# Altium schematic sheet DAC Output.SchDoc
size 297 x 209 mm; CompanyName: Sainsbury Wellcome Centre; Organization: FabLab; Address1: Sainsbury Wellcome Centre; Address2: 25 Howland Street; Address3: London; Address4: W1T 4JG; DocumentNumber: 11; SheetNumber: 11; SheetTotal: 12; swcgroup: FabLab; Org: Sainsbury Wellcome Centre; Add1: 25 Howland Street; Add2: London; Add3: W1T 4JG; WebAddress: www.sainsburywellcome.org; SheetSize: A4; SheetName: Level Shifter
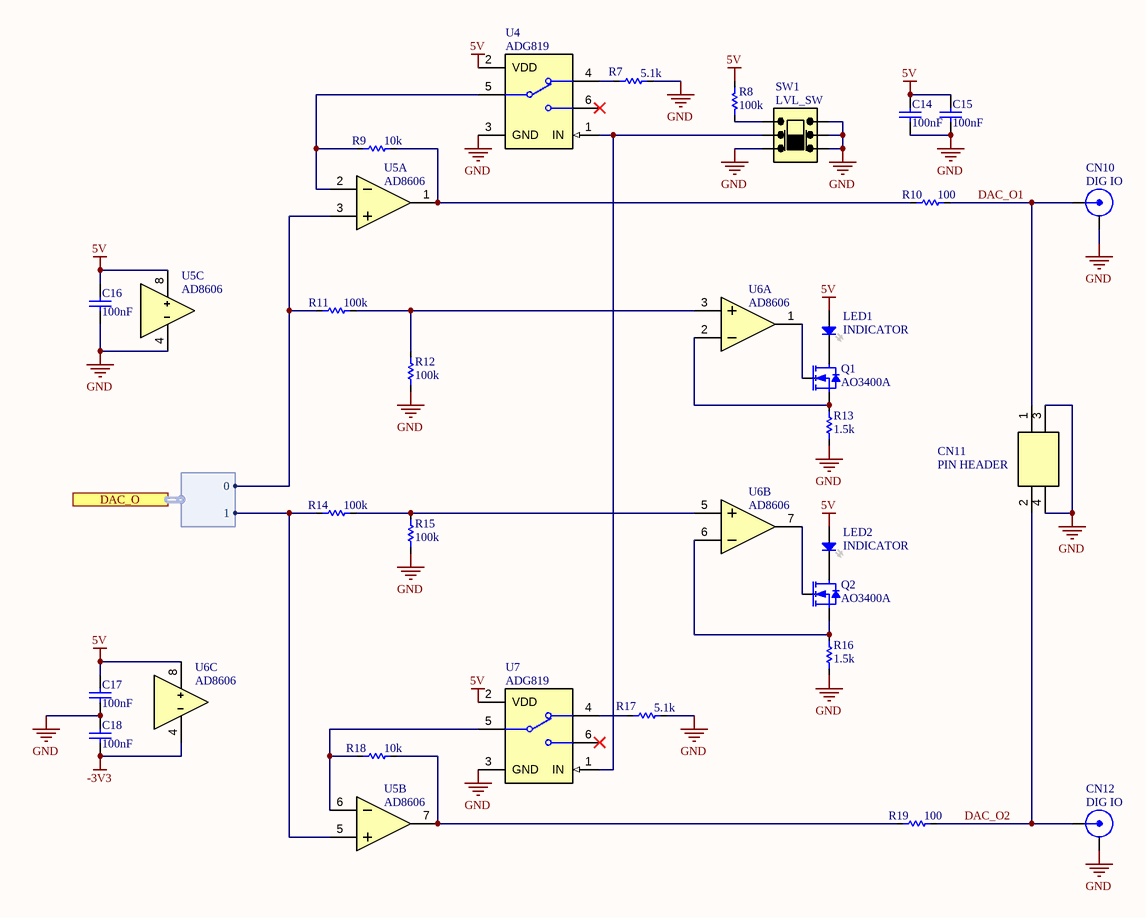
[diagram p0: DAC Output.SchDoc]

## Parts
C14  value 100nF  [CAP_CHIP_0603]  (hidden comment: C0603-100nF-50V)
C15  value 100nF  [CAP_CHIP_0603]  (hidden comment: C0603-100nF-50V)
C16  value 100nF  [CAP_CHIP_0603]  (hidden comment: C0603-100nF-50V)
C17  value 100nF  [CAP_CHIP_0603]  (hidden comment: C0603-100nF-50V)
C18  value 100nF  [CAP_CHIP_0603]  (hidden comment: C0603-100nF-50V)
CN10  DIG IO  [BNC-AMP-112515]
CN11  PIN HEADER  [PIN_2.54_2X2P]
CN12  DIG IO  [BNC-AMP-112515]
LED1  INDICATOR  [LED_CHIP_0805]
LED2  INDICATOR  [LED_CHIP_0805]
Q1  AO3400A  [SOT23]
Q2  AO3400A  [SOT23]
R7  value 5.1k  [RES_CHIP_0603]  (hidden comment: R0603-5K1)
R8  value 100k  [RES_CHIP_0603]  (hidden comment: R0603-100K)
R9  value 10k  [RES_CHIP_0603]  (hidden comment: R0603-10K)
R10  value 100  [RES_CHIP_0603]  (hidden comment: R0603-100R)
R11  value 100k  [RES_CHIP_0603]  (hidden comment: R0603-100K)
R12  value 100k  [RES_CHIP_0603]  (hidden comment: R0603-100K)
R13  value 1.5k  [RES_CHIP_0603]  (hidden comment: R0603-1K5)
R14  value 100k  [RES_CHIP_0603]  (hidden comment: R0603-100K)
R15  value 100k  [RES_CHIP_0603]  (hidden comment: R0603-100K)
R16  value 1.5k  [RES_CHIP_0603]  (hidden comment: R0603-1K5)
R17  value 5.1k  [RES_CHIP_0603]  (hidden comment: R0603-5K1)
R18  value 10k  [RES_CHIP_0603]  (hidden comment: R0603-10K)
R19  value 100  [RES_CHIP_0603]  (hidden comment: R0603-100R)
SW1  LVL_SW  [SW_SLIDE_OS202013MT8]
U4  ADG819  [SOT23-6]
U5  AD8606  [VSSOP8_3X3_0.65E]  (parts A,B,C of 3)
U6  AD8606  [VSSOP8_3X3_0.65E]  (parts A,B,C of 3)
U7  ADG819  [SOT23-6]

## Ports
DAC_O (harness DAC_O)

## Harnesses
DAC_O: 1, 0

## Nets
5V: C14.2 C15.2 C16.2 C17.2 LED1.2(A) LED2.2(A) R8.2 U4.2(VDD) U5.8(V+) U6.8(V+) U7.2(VDD)
-3V3: C18.1 U6.4(V-)
GND: C14.1 C15.1 C16.1 C17.1 C18.2 CN10.2(GND) CN11.3 CN11.4 CN12.2(GND) R7.2 R12.1 R13.1 R15.1 R16.1 R17.2 SW1.1(NCA) SW1.4(NCB) SW1.5(COMB) SW1.6(NOB) U4.3(GND) U5.4(V-) U7.3(GND)
DAC_O1: CN10.1(SIG) CN11.1 R10.2
DAC_O2: CN11.2 CN12.1(SIG) R19.2
NetLED1_1: LED1.1(K) Q1.3(D)
NetLED2_1: LED2.1(K) Q2.3(D)
NetQ1_1: Q1.1(G) U6.1(AOUT)
NetQ1_2: Q1.2(S) R13.2 U6.2(A-)
NetQ2_1: Q2.1(G) U6.7(BOUT)
NetQ2_2: Q2.2(S) R16.2 U6.6(B-)
NetR7_1: R7.1 U4.4(S1)
NetR8_1: R8.1 SW1.3(NOA)
NetR9_1: R9.1 U4.5(D) U5.2(A-)
NetR9_2: R9.2 R10.1 U5.1(AOUT)
NetR11_1: R11.1 R12.2 U6.3(A+)
NetR11_2: R11.2 U5.3(A+) ; port DAC_O.0
NetR14_1: R14.1 R15.2 U6.5(B+)
NetR14_2: R14.2 U5.5(B+) ; port DAC_O.1
NetR17_1: R17.1 U7.4(S1)
NetR18_1: R18.1 U5.6(B-) U7.5(D)
NetR18_2: R18.2 R19.1 U5.7(BOUT)
NetSW1_2: SW1.2(COMA) U4.1(IN) U7.1(IN)

Not connected (* = marked no-connect by the designer): U4 6(S2)*; U7 6(S2)*

## Notes on the sheet
- FILE
- VARIANT
- DATE
- REVISION
- SHEET
- /
- PROJECT
- SIZE

## Library data of the parts
C14-C18 = CMP-611-0027-24: 0603 Multilayer Ceramic Capacitors MLCC; PartNumber: CC0603KRX7R9BB104; Tolerance: 10%; Pick&PlaceFootprint: C0603; Dielectric: X7R; Voltage Rating: 50V; Capacitor Type: Ceramic; RoHS: Yes; Mount: SMD; LCSC Part N.: C14663; Case/Package: 0603
CN10 CN12 = CMP-730-0003-11: RF BNC Connector, Female, Board Mount, Solder Terminal, Jack; PartNumber: 112515; Clock Frequency: 4GHz; Characteristic Impedance: 50R; LCSC Part N.: C3176191; Orientation: Straight; Connector Type: BNC; Gender: Female
CN11 = CMP-380-0037-5: Straight Policy 2.5mm 6mm -40℃~+105℃ 3mm 2.54mm Double Row Black Brass 2.54mm Plugin,P=2.54mm Pin Headers; PartNumber: PZ254V-12-4P; Gender: Male; Number of Contacts: 4; Number of Positions: 2; Pitch: 2.54mm; Number of Rows: 2; Mount: Through Hole; Orientation: Straight; LCSC Part N.: C492419
LED1 LED2 = CMP-520-0018-2: White 0805 Light Emitting Diodes (LED) ROHS; PartNumber: KT-0805W; Forward Current: 25mA; Wavelength: 405nm; Pick&PlaceFootprint: LED0805; Forward Voltage: 2.9V; Colour: White; LCSC Part N.: C34499; Mount: Surface Mount
Q1 Q2 = CMP-810-0002-2: 30V 5.7A 26.5mΩ@10V,5.7A 1.4W 1.5V@250uA 1 NChannel SOT-23-3L MOSFETs; Gate-Source Voltage (Vgs): 12V; Pick&PlaceFootprint: SOT-23; RDS(ON): 26.5mR; Switching Time: 34.5ns; LCSC Part N.: C20917; Drain-Source Voltage (Vds): 30V; Mount: Surface Mount; PartNumber: AO3400A; Power Dissipation: 1.4W; Drain Current (Id): 5.7A; Polarity: N Channel
R7 R17 = CMP-633-0090-12: 100mW Thick Film Resistors 75V ±100ppm/℃ ±1% 0603 Chip Resistor; PartNumber: 0603WAF5101T5E; Number of Resistors: 1; Pick&PlaceFootprint: R0603; Voltage Rating: 75V; Case/Package: 0603; Power Rating: 100mW; Tolerance: 1%; LCSC Part N.: C23186; Mount: Surface Mount
R8 R11 R12 R14 R15 = CMP-633-0000-28: 100mW Thick Film Resistors 75V ±100ppm/℃ ±1% 0603 Chip Resistor; PartNumber: 0603WAF1003T5E; Number of Resistors: 1; Pick&PlaceFootprint: R0603; LCSC Part N.: C25803; Mount: Surface Mount; Voltage Rating: 75V; Power Rating: 100mW; Case/Package: 0603; Tolerance: 1%
R9 R18 = CMP-633-0002-26: 100mW Thick Film Resistors 75V ±100ppm/℃ ±1% 0603 Chip Resistor; PartNumber: 0603WAF1002T5E; Number of Resistors: 1; Pick&PlaceFootprint: R0603; Case/Package: 0603; Voltage Rating: 75V; Power Rating: 100mW; LCSC Part N.: C25804; Tolerance: 1%; Mount: Surface Mount
R10 R19 = CMP-633-0094-12: 100mW Thick Film Resistors 75V ±100ppm/℃ ±1% 0603 Chip Resistor; PartNumber: 0603WAF1000T5E; Number of Resistors: 1; Pick&PlaceFootprint: R0603; Case/Package: 0603; Voltage Rating: 75V; Mount: Surface Mount; Tolerance: 1%; LCSC Part N.: C22775; Power Rating: 100mW
R13 R16 = CMP-633-0029-25: 100mW Thick Film Resistors 75V ±100ppm/℃ ±1% 0603 Chip Resistor; PartNumber: 0603WAF1501T5E; Number of Resistors: 1; Pick&PlaceFootprint: R0603; Voltage Rating: 75V; Tolerance: 1%; Mount: Surface Mount; Case/Package: 0603; LCSC Part N.: C22843; Power Rating: 100mW
SW1 = CMP-B00-0028-1: Switch Slide ON ON DPDT Top Slide 0.3A 30VDC 10000Cycles PC Pins Thru-Hole Bulk; PartNumber: OS202013MT8QN1; Switch Travel: 3.2mm; Switch Function: On-On; Voltage Rating (DC): 30V; Throw Configuration: DPDT; Orientation: Straight; LCSC Part N.: C2799227
U4 U7 = CMP-9A0-0003-1: Analog Switch/Analog Multiplexer Single 2: 1 Automotive 6-Pin SOT-23 T/R; PartNumber: ADG819BRTZ-REEL7; Throw Configuration: SPDT; On-State Resistance: 600mR; Number of Channels: 1; Max Supply Voltage: 5.5V; Min Supply Voltage: 1.8V; Bandwidth: 17MHz; LCSC Part N.: C579118
U5 U6 = CMP-941-0002-4: Operational Amplifier, 2 Func, 750uV Offset-Max, CMOS, PDSO8; PartNumber: AD8606ARMZ-REEL; Pick&PlaceFootprint: MSOP-8; Slew Rate: 5V/µs; Min Supply Voltage: 0V; Input Offset Voltage: 65µV; CMRR: 100dB; Max Supply Voltage: 5V; Voltage Drift: 4.5µV/°C; PSRR: 95dB; Quiescent Current: 1mA; Max Supply Current: 80mA; Gain Bandwidth: 10MHz; LCSC Part N.: C459905